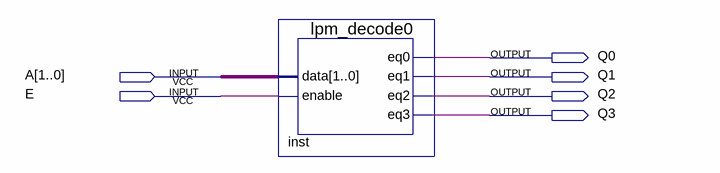
[diagram p0: schematic sheet]
// Quartus schematic Q3.bdf as structural Verilog: 1 symbols, 6 pins
module Q3 (
  input  [1:0] A,
  input  E,
  output Q0,
  output Q1,
  output Q2,
  output Q3
);

  lpm_decode0 inst (.data(A), .enable(E), .eq0(Q0), .eq1(Q1), .eq2(Q2), .eq3(Q3));
endmodule
